# Altium project RPI_LP_Motor_Hat.PrjPcb
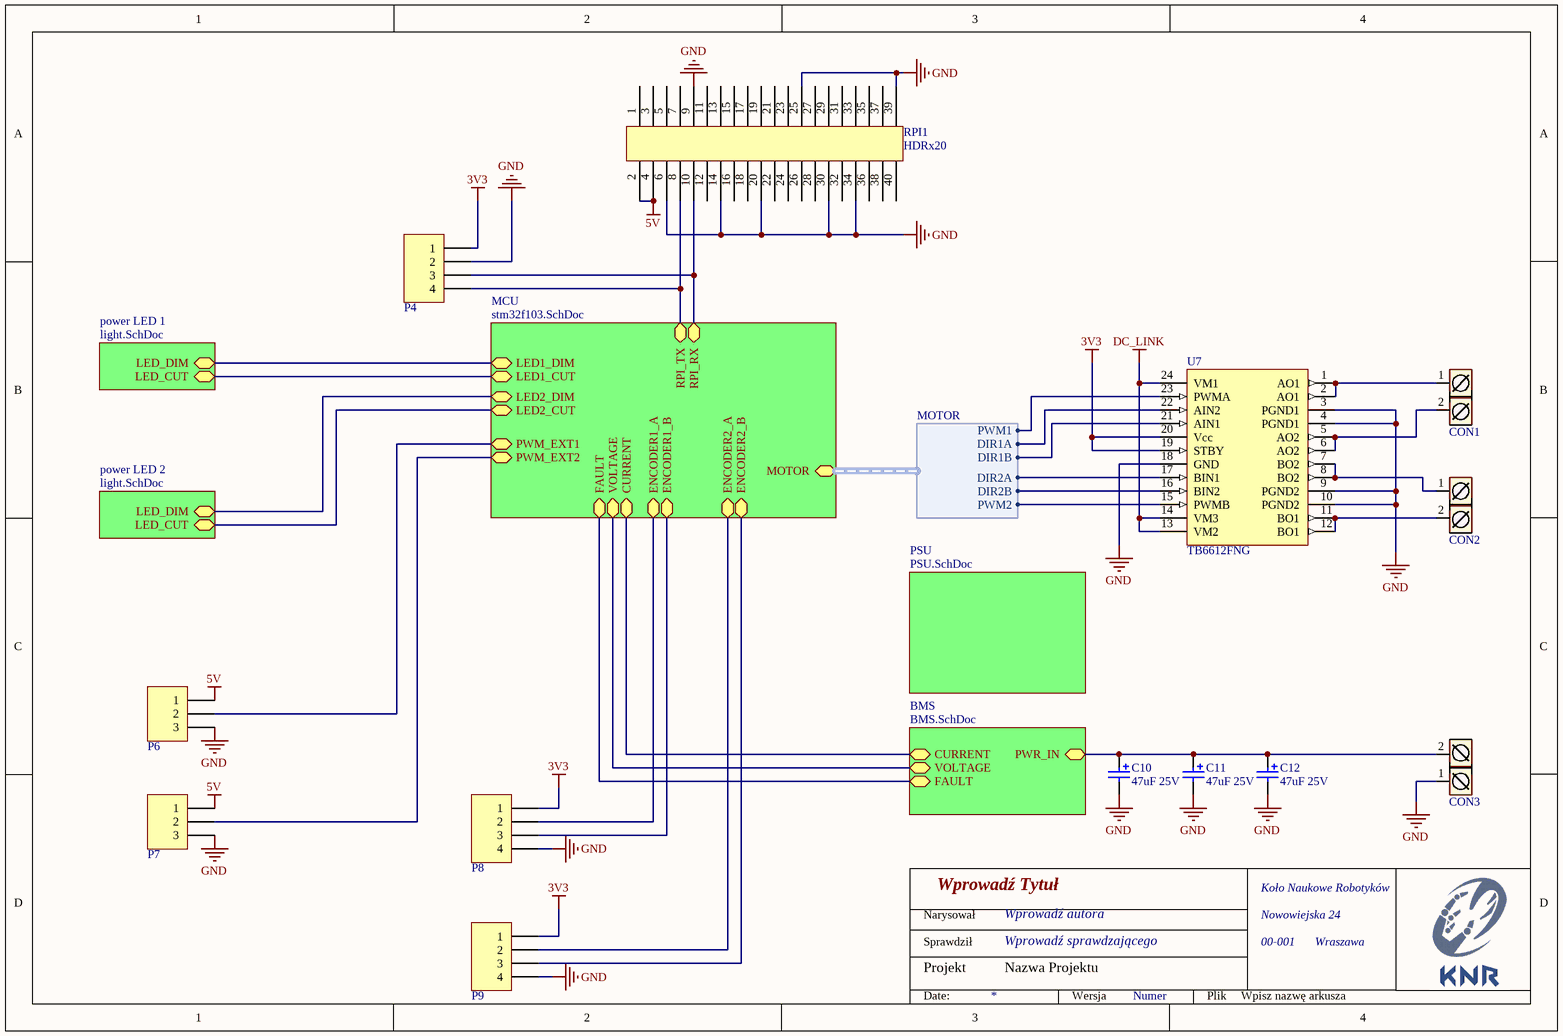
[diagram p0: motor hat.SchDoc]
5 sheets, 84 parts. Net scope: hierarchical (ports join the sheet entries above them; power ports are global).
Board file: RPI_LP_motor_hat.PcbDoc
Sheets:
  motor hat.SchDoc
    MCU = stm32f103.SchDoc
    PSU = PSU.SchDoc
    power LED 1 = light.SchDoc
    power LED 2 = light.SchDoc
    BMS = BMS.SchDoc

## Sheet motor hat.SchDoc: Wprowadź Tytuł
size A4; CheckedBy: Wprowadź sprawdzającego; DrawnBy: Wprowadź autora; Organization: Koło Naukowe Robotyków; Address1: Nowowiejska 24; Address2: 00-001; Address3: Wraszawa; Address4: Polska; Revision: Numer; Nazwa Arkusza: Wpisz nazwę arkusza; ProjectName: Nazwa Projektu

### Parts
C10  47uF 25V  [ELECTROLYTIC 5mm]
C11  47uF 25V  [ELECTROLYTIC 5mm]
C12  47uF 25V  [ELECTROLYTIC 5mm]
CON1  ARK2  [ARK2]  (value not drawn)
CON2  ARK2  [ARK2]  (value not drawn)
CON3  ARK2  [ARK2]  (value not drawn)
P4  HDR1X4  [HDR1X4]  (value not drawn)
P6  HDR1X3  [HDR1X3]  (value not drawn)
P7  HDR1X3  [HDR1X3]  (value not drawn)
P8  HDR1X4  [HDR1X4]  (value not drawn)
P9  HDR1X4  [HDR1X4]  (value not drawn)
RPI1  HDRx20  [HDR2x20]
U7  TB6612FNG  [SSOP24-P-300]

### Sub-sheets
BMS = BMS.SchDoc: PWR_IN, CURRENT, VOLTAGE, FAULT
MCU = stm32f103.SchDoc: LED1_DIM, LED2_DIM, LED2_CUT, LED1_CUT, PWM_EXT1, PWM_EXT2, CURRENT, VOLTAGE, FAULT, ENCODER1_A, ENCODER1_B, ENCODER2_A, ENCODER2_B, RPI_TX, RPI_RX, MOTOR (harness MOTOR)
power LED 1 = light.SchDoc: LED_CUT, LED_DIM
power LED 2 = light.SchDoc: LED_CUT, LED_DIM
PSU = PSU.SchDoc: no entries

### Harnesses
MOTOR: DIR2B, DIR2A, PWM2, PWM1, DIR1B, DIR1A

### Nets
3V3: P4.1 P8.1 P9.1 U7.19(STBY) U7.20(Vcc)
5V: P6.1 P7.1 RPI1.2 RPI1.4
DC_LINK: U7.13(VM2) U7.14(VM3) U7.24(VM1)
GND: C10.2 C11.2 C12.2 CON3.1 P4.2 P6.3 P7.3 P8.4 P9.4 RPI1.6 RPI1.9 RPI1.14 RPI1.20 RPI1.25 RPI1.30 RPI1.34 RPI1.39 U7.3(PGND1) U7.4(PGND1) U7.9(PGND2) U7.10(PGND2) U7.18(GND)
DIR1A: U7.22(AIN2) ; sheet MCU/MOTOR.DIR1A
DIR1B: U7.21(AIN1) ; sheet MCU/MOTOR.DIR1B
DIR2A: U7.17(BIN1) ; sheet MCU/MOTOR.DIR2A
DIR2B: U7.16(BIN2) ; sheet MCU/MOTOR.DIR2B
PWM1: U7.23(PWMA) ; sheet MCU/MOTOR.PWM1
PWM2: U7.15(PWMB) ; sheet MCU/MOTOR.PWM2
NetC2_2: sheet MCU/CURRENT, sheet BMS/CURRENT
NetC10_1: C10.1 C11.1 C12.1 CON3.2 ; sheet BMS/PWR_IN
NetCON1_1: CON1.1 U7.1(AO1) U7.2(AO1)
NetCON1_2: CON1.2 U7.5(AO2) U7.6(AO2)
NetCON2_1: CON2.1 U7.7(BO2) U7.8(BO2)
NetCON2_2: CON2.2 U7.11(BO1) U7.12(BO1)
NetP4_3: P4.3 RPI1.10 ; sheet MCU/RPI_RX
NetP4_4: P4.4 RPI1.8 ; sheet MCU/RPI_TX
NetP6_2: P6.2 ; sheet MCU/PWM_EXT1
NetP7_2: P7.2 ; sheet MCU/PWM_EXT2
NetP8_2: P8.2 ; sheet MCU/ENCODER1_A
NetP8_3: P8.3 ; sheet MCU/ENCODER1_B
NetP9_2: P9.2 ; sheet MCU/ENCODER2_A
NetP9_3: P9.3 ; sheet MCU/ENCODER2_B
NetR1_1: sheet MCU/FAULT, sheet BMS/FAULT
NetR2_1: sheet MCU/VOLTAGE, sheet BMS/VOLTAGE
NetR5_1_1: sheet MCU/LED1_CUT, sheet power LED 1/LED_CUT
NetR5_2_1: sheet MCU/LED2_CUT, sheet power LED 2/LED_CUT
NetU2_1_3: sheet MCU/LED1_DIM, sheet power LED 1/LED_DIM
NetU2_2_3: sheet MCU/LED2_DIM, sheet power LED 2/LED_DIM

Not connected (* = marked no-connect by the designer): RPI1 1 3 5 7 11 12 13 15 16 17 18 19 21 22 23 24 26 27 28 29 31 32 33 35 36 37 38 40

### Notes on the sheet
- Narysował
- Sprawdził
- Projekt
- Date:
- Wersja
- Plik

### Library data of the parts
C10-C12 = Electrolytic: Electrolytic capacitor; Value: 47uF 25V
CON1-CON3 = ARK2: Złącze śrubowe 2 piny
P4 P8 P9 = HDR1X4: Header, 4-Pin; LatestRevisionDate: 17-Jul-2002; LatestRevisionNote: Re-released for DXP Platform.; Publisher: Altium Limited
P6 P7 = HDR1X3: Header, 3-Pin; LatestRevisionDate: 17-Jul-2002; LatestRevisionNote: Re-released for DXP Platform.; Publisher: Altium Limited
U7 = TB6612FNG: Driver IC for Dual DC motor

## Sheet stm32f103.SchDoc: Wprowadź Tytuł
size A4; CheckedBy: Wprowadź sprawdzającego; DrawnBy: Wprowadź autora; Organization: Koło Naukowe Robotyków; Address1: Nowowiejska 24; Address2: 00-001; Address3: Wraszawa; Address4: Polska; Revision: Numer; Nazwa Arkusza: Wpisz nazwę arkusza; ProjectName: Nazwa Projektu
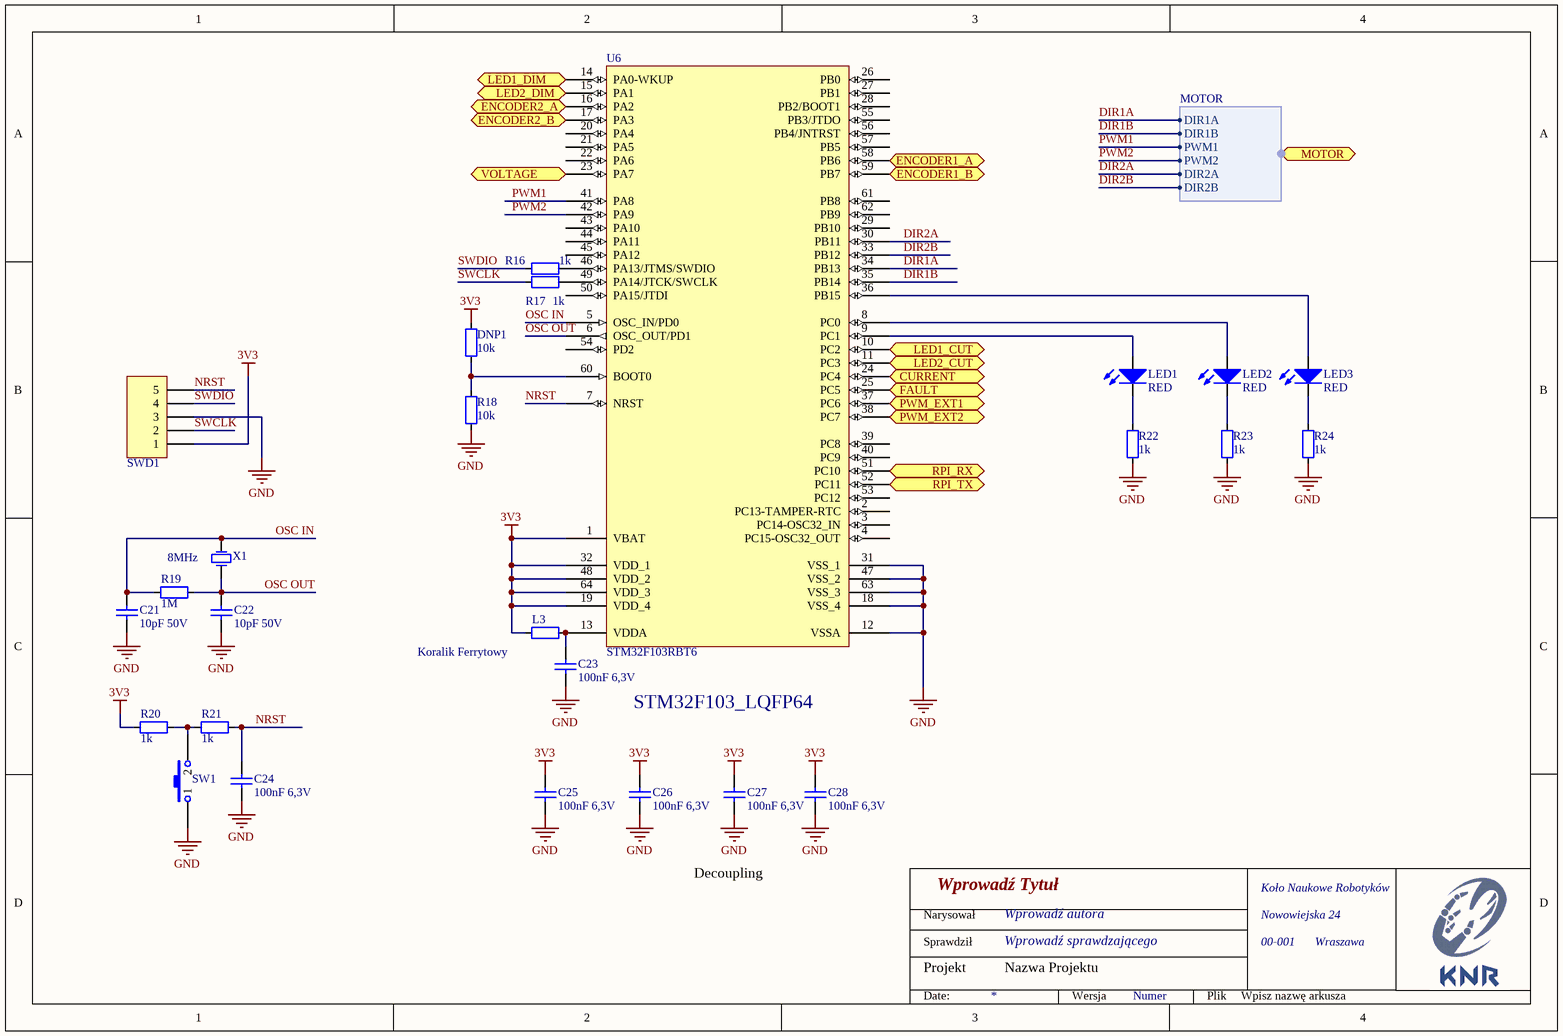
[diagram p1: stm32f103.SchDoc]

### Parts
C21  10pF 50V  [0603_CAP]
C22  10pF 50V  [0603_CAP]
C23  100nF 6,3V  [0603_CAP]
C24  100nF 6,3V  [0603_CAP]
C25  100nF 6,3V  [0603_CAP]
C26  100nF 6,3V  [0603_CAP]
C27  100nF 6,3V  [0603_CAP]
C28  100nF 6,3V  [0603_CAP]
DNP1  10k  [0603]
L3  Koralik Ferrytowy  [0603]
LED1  RED  [0603_led_green]
LED2  RED  [0603_led_red]
LED3  RED  [0603_led_blue]
R16  1k  [0603]
R17  1k  [0603]
R18  10k  [0603]
R19  1M  [0603]
R20  1k  [0603]
R21  1k  [0603]
R22  1k  [RES_0603]
R23  1k  [RES_0603]
R24  1k  [RES_0603]
SW1  Micro_Switch  [Tact 34N-F]  (value not drawn)
SWD1  HDR1X5  [Molex SPOX Horizontal 5 Circuits]  (value not drawn)
U6  STM32F103RBT6  [LQFP64_L]
X1  8MHz  [HC49-4H_THT]

### Ports
CURRENT, ENCODER1_A, ENCODER1_B, ENCODER2_A, ENCODER2_B, FAULT, LED1_CUT, LED1_DIM, LED2_CUT, LED2_DIM, MOTOR (harness MOTOR), PWM_EXT1, PWM_EXT2, RPI_RX, RPI_TX, VOLTAGE

### Harnesses
MOTOR: DIR2B, DIR2A, PWM2, PWM1, DIR1B, DIR1A

### Nets
3V3: C25.1 C26.1 C27.1 C28.1 DNP1.1 L3.1 R20.2 SWD1.1 U6.1(VBAT) U6.19(VDD_4) U6.32(VDD_1) U6.48(VDD_2) U6.64(VDD_3)
GND: C21.2 C22.2 C23.2 C24.2 C25.2 C26.2 C27.2 C28.2 R18.2 R22.1 R23.1 R24.1 SW1.1 SWD1.3 U6.12(VSSA) U6.18(VSS_4) U6.31(VSS_1) U6.47(VSS_2) U6.63(VSS_3)
DIR1A: U6.34(PB13) ; port MOTOR.DIR1A
DIR1B: U6.35(PB14) ; port MOTOR.DIR1B
DIR2A: U6.30(PB11) ; port MOTOR.DIR2A
DIR2B: U6.33(PB12) ; port MOTOR.DIR2B
NRST: C24.1 R21.1 SWD1.5 U6.7(NRST)
OSC IN: C21.1 R19.2 U6.5(OSC_IN/PD0) X1.1(OSC1)
OSC OUT: C22.1 R19.1 U6.6(OSC_OUT/PD1) X1.2(OSC2)
PWM1: U6.41(PA8) ; port MOTOR.PWM1
PWM2: U6.42(PA9) ; port MOTOR.PWM2
SWCLK: R17.1 SWD1.2
SWDIO: R16.1 SWD1.4
NetC2_2: U6.24(PC4) ; port CURRENT
NetC23_1: C23.1 L3.2 U6.13(VDDA)
NetDNP1_2: DNP1.2 R18.1 U6.60(BOOT0)
NetLED1_1: LED1.1(A) U6.9(PC1)
NetLED1_2: LED1.2(K) R22.2
NetLED2_1: LED2.1(A) U6.8(PC0)
NetLED2_2: LED2.2(K) R23.2
NetLED3_1: LED3.1(A) U6.36(PB15)
NetLED3_2: LED3.2(K) R24.2
NetP4_3: U6.51(PC10) ; port RPI_RX
NetP4_4: U6.52(PC11) ; port RPI_TX
NetP6_2: U6.37(PC6) ; port PWM_EXT1
NetP7_2: U6.38(PC7) ; port PWM_EXT2
NetP8_2: U6.58(PB6) ; port ENCODER1_A
NetP8_3: U6.59(PB7) ; port ENCODER1_B
NetP9_2: U6.16(PA2) ; port ENCODER2_A
NetP9_3: U6.17(PA3) ; port ENCODER2_B
NetR1_1: U6.25(PC5) ; port FAULT
NetR2_1: U6.23(PA7) ; port VOLTAGE
NetR5_1_1: U6.10(PC2) ; port LED1_CUT
NetR5_2_1: U6.11(PC3) ; port LED2_CUT
NetR16_2: R16.2 U6.46(PA13/JTMS/SWDIO)
NetR17_2: R17.2 U6.49(PA14/JTCK/SWCLK)
NetR20_1: R20.1 R21.2 SW1.2
NetU2_1_3: U6.14(PA0-WKUP) ; port LED1_DIM
NetU2_2_3: U6.15(PA1) ; port LED2_DIM

Not connected (* = marked no-connect by the designer): U6 2(PC13-TAMPER-RTC) 3(PC14-OSC32_IN) 4(PC15-OSC32_OUT) 20(PA4) 21(PA5) 22(PA6) 26(PB0) 27(PB1) 28(PB2/BOOT1) 29(PB10) 39(PC8) 40(PC9) 43(PA10) 44(PA11) 45(PA12) 50(PA15/JTDI) 53(PC12) 54(PD2) 55(PB3/JTDO) 56(PB4/JNTRST) 57(PB5) 61(PB8) 62(PB9)

### Notes on the sheet
- STM32F103_LQFP64
- Decoupling
- Narysował
- Sprawdził
- Projekt
- Date:
- Wersja
- Plik

### Library data of the parts
C21-C28 = Cap: Ceramic capacitor; Unit Price1: *; Unit Price2: *
  C21 C22: Value: 10pF 50V
  C23-C28: Value: 100nF 6,3V
DNP1 L3 R16-R21 = RES: Resistior
  DNP1 R18: Value: 10k
  L3: Value: Koralik Ferrytowy
  R16 R17 R20 R21: Value: 1k
  R19: Value: 1M
LED1-LED3 = LED: Light-emitting diode; COLOR: RED
R22-R24 = Resistor: Default resistor; Value: 1k
SW1 = Micro_Switch: Switch; Published: 24-Mar-1999; LatestRevisionDate: 17-Jul-2002; LatestRevisionNote: Re-released for DXP Platform.; PackageReference: SPST-2; Publisher: Altium Limited
SWD1 = HDR1X5: Header, 5-Pin; LatestRevisionDate: 17-Jul-2002; LatestRevisionNote: Re-released for DXP Platform.; Publisher: Altium Limited
U6 = STM32F103RBT6: STM32 ARM-based 32-bit; Published: 30-May-2008; DatasheetVersion: rev6, Mar-2008; PackageVersion: Mar-2008; PackageReference: LQFP64; Publisher: Altium Limited; PackageDescription: 64-Pin Low-Profile Quad Flat Pack, 10 x 10 mm Body, 0.5 mm Pitch (LQFP64); ComponentLink1Description: Manufacturer Link; ComponentLink1URL: www.st.com/stm32; ComponentLink2Description: Datasheet; ComponentLink2URL: http://www.st.com/stonline/products/literature/ds/13587.pdf
X1 = XTAL: Oscillator; Unit Price1: *; Unit Price2: *; Value: 8MHz

## Sheet PSU.SchDoc: Wprowadź Tytuł
size A4; CheckedBy: Wprowadź sprawdzającego; DrawnBy: Wprowadź autora; Organization: Koło Naukowe Robotyków; Address1: Nowowiejska 24; Address2: 00-001; Address3: Wraszawa; Address4: Polska; Revision: Numer; Nazwa Arkusza: Wpisz nazwę arkusza; ProjectName: Nazwa Projektu
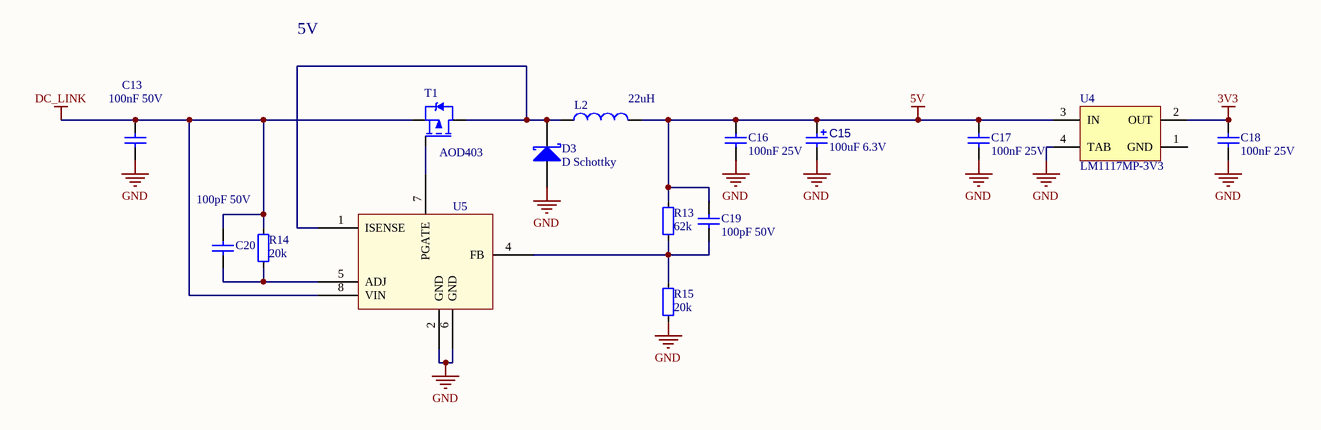
[diagram p2: PSU.SchDoc]

### Parts
C13  100nF 50V  [0603_CAP]
C15  100uF 6.3V  [Con_SMD_6.3x5.5]
C16  100nF 25V  [0603_CAP]
C17  100nF 25V  [0603_CAP]
C18  100nF 25V  [0603_CAP]
C19  100pF 50V  [0603_CAP]
C20  100pF 50V  [0603_CAP]
D3  D Schottky  [SMB]
L2  22uH  [PA4341.223ANLT]
R13  62k  [0603]
R14  20k  [0603]
R15  20k  [0603]
T1  AOD403  [DPAK TO-252]
U4  LM1117MP-3V3  [SOT223]
U5  LM3485  [VSSOP8]  (value not drawn)

### Nets
3V3: C18.2 U4.2(OUT)
5V: C15.1 C16.2 C17.2 C19.2 L2.2 R13.2 U4.3(IN)
DC_LINK: C13.2 C20.2 R14.2 T1.3(S) U5.8(VIN)
GND: C13.1 C15.2 C16.1 C17.1 C18.1 D3.1(A) R15.1 U4.4(TAB) U5.2(GND) U5.6(GND)
NetC19_1: C19.1 R13.1 R15.2 U5.4(FB)
NetC20_1: C20.1 R14.1 U5.5(ADJ)
NetD3_2: D3.2(K) L2.1 T1.2(D) U5.1(ISENSE)
NetT1_1: T1.1(G) U5.7(PGATE)

Not connected (* = marked no-connect by the designer): U4 1(GND)

### Notes on the sheet
- 5V
- Narysował
- Sprawdził
- Projekt
- Date:
- Wersja
- Plik

### Library data of the parts
C13 C16-C20 = Cap: Ceramic capacitor; Unit Price1: *; Unit Price2: *
  C13: Value: 100nF 50V
  C16-C18: Value: 100nF 25V
  C19 C20: Value: 100pF 50V
C15 = Cap_Pol: Polar capacitor; Value: 100uF 6.3V
D3 = D Schottky: Schottky Diode; Published: 8-Jun-2000; LatestRevisionDate: 17-Jul-2002; LatestRevisionNote: Re-released for DXP Platform.; PackageReference: SMB; Publisher: Altium Limited; PackageDescription: DO-214-AA/SMB; 2 C-Bend Leads; Body 5.3 x 3.6 mm, inc. leads (LxW); Code_JEDEC: DO-214-AA
L2 = Inductor
R13-R15 = RES: Resistior
  R13: Value: 62k
  R14 R15: Value: 20k
T1 = p-mosfet: AEC Generic p-mosfet; part_number: AOD403
U4 = LM1117MP-3V3: 800mA Low-Dropout Linear Regulator; PartNumber: LM1117MP-3.3; Manufacturer: National Semiconductor; CompType: LDO IC; PackageTopMarking: XYTT*N05A; PowerWise: N; Published: 4-Dec-2008; DatasheetVersion: Apr-2006; PackageVersion: revB, Apr-2003; PackageReference: MP04A; Publisher: Altium Limited; PackageDescription: Molded SOT-223, 6.50 x 3.56 x 1.6mm Body, 4 Lead, 2.3mm Pitch; RoHS: O; PinCount: 4; DigiKeyPartNumber: LM1117MP-3.3CT-ND; Code_JEDEC: TO-261-AA; Code_IPC: SOT223-4; ComponentLink1Description: LM1117 Datasheet; ComponentLink1URL: http://www.national.com/ds/LM/LM1117.pdf; ComponentLink2Description: LM1117 Web Page; ComponentLink2URL: http://www.national.com/pf/LM/LM1117.html; ComponentLink3Description: MP04A Package Page; ComponentLink3URL: http://www.national.com/packaging/folders/mp04a.html
U5 = LM3485: HelpURL: C:\Users\micha\Documents\Studia\Inżynierka\Elektronika\Datasheets\LM3485.pdf

## Sheet light.SchDoc: Wprowadź Tytuł
size A4; CheckedBy: Wprowadź sprawdzającego; DrawnBy: Wprowadź autora; Organization: Koło Naukowe Robotyków; Address1: Nowowiejska 24; Address2: 00-001; Address3: Wraszawa; Address4: Polska; Revision: Numer; Nazwa Arkusza: Wpisz nazwę arkusza; ProjectName: Nazwa Projektu
Used 2 times, as channels power LED 1, power LED 2. Parts and nets are listed once, with the designators drawn on the sheet.
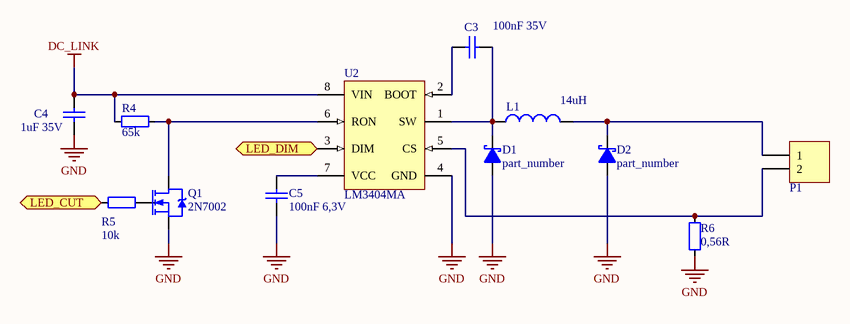
[diagram p3: light.SchDoc]

### Parts
C3  100nF 35V  [0603_CAP]
C4  1uF 35V  [0603_CAP]
C5  100nF 6,3V  [0603_CAP]
D1  part_number  [DO-219AB (SMF)]
D2  part_number  [DO-219AB (SMF)]
L1  14uH  [PA4341.223ANLT]
P1  HDR1X2  [HDR1X2]  (value not drawn)
Q1  2N7002  [Sot23]
R4  65k  [0603]
R5  10k  [0603]
R6  0,56R  [1206]
U2  LM3404MA  [M08A_N]

### Ports
LED_CUT, LED_DIM

### Nets
DC_LINK: C4.2 R4.1 U2.8(VIN)
GND: C4.1 C5.1 D1.1(A) D2.1(A) Q1.3(S) R6.1 U2.4(GND)
LED_CUT: R5.1 ; port LED_CUT
LED_DIM: U2.3(DIM) ; port LED_DIM
NetC3_1: C3.1 D1.2(K) L1.1 U2.1(SW)
NetC3_2: C3.2 U2.2(BOOT)
NetC5_2: C5.2 U2.7(VCC)
NetD2_2: D2.2(K) L1.2 P1.1
NetP1_2: P1.2 R6.2 U2.5(CS)
NetQ1_1: Q1.1(G) R5.2
NetQ1_2: Q1.2(D) R4.2 U2.6(RON)

### Channels
power LED 1: designators C3=C3_1 C4=C4_1 C5=C5_1 D1=D1_1 D2=D2_1 L1=L1_1 P1=PWR_LED1 Q1=Q1_1 R4=R4_1 R5=R5_1 R6=R6_1 U2=U2_1; ports LED_CUT=NetR5_1_1 LED_DIM=NetU2_1_3
power LED 2: designators C3=C3_2 C4=C4_2 C5=C5_2 D1=D1_2 D2=D2_2 L1=L1_2 P1=PWR_LED2 Q1=Q1_2 R4=R4_2 R5=R5_2 R6=R6_2 U2=U2_2; ports LED_CUT=NetR5_2_1 LED_DIM=NetU2_2_3

### Notes on the sheet
- Narysował
- Sprawdził
- Projekt
- Date:
- Wersja
- Plik

### Library data of the parts
C3-C5 = Cap: Ceramic capacitor; Unit Price1: *; Unit Price2: *
  C3: Value: 100nF 35V
  C4: Value: 1uF 35V
  C5: Value: 100nF 6,3V
D1 D2 = Schottky: part_number: part_number
L1 = Inductor
P1 = HDR1X2: Header, 2-Pin; LatestRevisionDate: 17-Jul-2002; LatestRevisionNote: Re-released for DXP Platform.; Publisher: Altium Limited
R4-R6 = RES: Resistior
  R4: Value: 65k
  R5: Value: 10k
  R6: Value: 0,56R
U2 = LM3404MA: 1.0A Constant Current Buck Regulator for High Power LED Drivers, 8-pin Narrow SOIC; Manufacturer: National Semiconductor; PackageTopMarking: NSZXTT*L3404*MA; PowerWise: Y; CompType: MiscPower; DatasheetVersion: Feb-2010; PackageVersion: revM, May-2009; PackageReference: M08A; PackageDescription: SOIC Narrow, 4.9 x 3.9 x 1.45mm, 8 Lead, 1.27mm Pitch; PartNumber: LM3404MA; RoHS: N; PinCount: 8; High-Reliability: Y; Code_JEDEC: MS-012-AA; Code_IPC: SOIC127P600-8; ComponentLink1Description: Manufacturer URL; ComponentLink1URL: http://www.national.com/; ComponentLink2Description: LM3404 Datasheet; ComponentLink2URL: http://www.national.com/ds/LM/LM3404.pdf; ComponentLink3Description: LM3404 Web Page; ComponentLink3URL: http://www.national.com/pf/LM/LM3404.html; ComponentLink4Description: M08A Package Page; ComponentLink4URL: http://www.national.com/packaging/folders/m08a.html; HelpURL: C:\Users\micha\Documents\Studia\Inżynierka\Elektronika\Datasheets\LM3404.pdf

## Sheet BMS.SchDoc: Wprowadź Tytuł
size A4; CheckedBy: Wprowadź sprawdzającego; DrawnBy: Wprowadź autora; Organization: Koło Naukowe Robotyków; Address1: Nowowiejska 24; Address2: 00-001; Address3: Wraszawa; Address4: Polska; Revision: Numer; Nazwa Arkusza: Wpisz nazwę arkusza; ProjectName: Nazwa Projektu
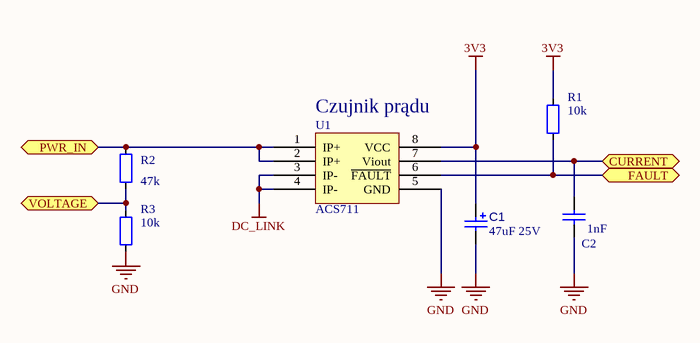
[diagram p4: BMS.SchDoc]

### Parts
C1  47uF 25V  [Con_SMD_5x5.5]
C2  1nF  [0603_CAP]
R1  10k  [0603]
R2  47k  [0603]
R3  10k  [0603]
U1  ACS711  [SO-8_N]

### Ports
CURRENT, FAULT, PWR_IN, VOLTAGE

### Nets
3V3: C1.1 R1.2 U1.8(VCC)
DC_LINK: U1.3(IP-) U1.4(IP-)
GND: C1.2 C2.1 R3.1 U1.5(GND)
NetC2_2: C2.2 U1.7(Viout) ; port CURRENT
NetC10_1: R2.2 U1.1(IP+) U1.2(IP+) ; port PWR_IN
NetR1_1: R1.1 U1.6(~{FAULT}) ; port FAULT
NetR2_1: R2.1 R3.2 ; port VOLTAGE

### Notes on the sheet
- (near U1) Czujnik prądu
- Narysował
- Sprawdził
- Projekt
- Date:
- Wersja
- Plik

### Library data of the parts
C1 = Cap_Pol: Polar capacitor; Value: 47uF 25V
C2 = Cap: Ceramic capacitor; Unit Price1: *; Unit Price2: *; Value: 1nF
R1-R3 = RES: Resistior
  R1 R3: Value: 10k
  R2: Value: 47k
U1 = ACS711: Current sensor. 12.5A or 25A at 3.3V; HelpURL: C:\Users\micha\Documents\Studia\Inżynierka\Elektronika\Datasheets\ACS711.pdf

## Nets that join several sheets
3V3: motor hat (5 pins), stm32f103 (13 pins), PSU (C18.2 U4.2), BMS (C1.1 R1.2 U1.8)
5V: motor hat (P6.1 P7.1 RPI1.2 RPI1.4), PSU (7 pins)
DC_LINK: motor hat (U7.13 U7.14 U7.24), PSU (5 pins), power LED 1 (C4_1.2 R4_1.1 U2_1.8), power LED 2 (C4_2.2 R4_2.1 U2_2.8), BMS (U1.3 U1.4)
GND: motor hat (22 pins), stm32f103 (19 pins), PSU (10 pins), power LED 1 (7 pins), power LED 2 (7 pins), BMS (C1.2 C2.1 R3.1 U1.5)
DIR1A: motor hat (U7.22), stm32f103 (U6.34)
DIR1B: motor hat (U7.21), stm32f103 (U6.35)
DIR2A: motor hat (U7.17), stm32f103 (U6.30)
DIR2B: motor hat (U7.16), stm32f103 (U6.33)
NetC2_2: stm32f103 (U6.24), BMS (C2.2 U1.7)
NetC10_1: motor hat (C10.1 C11.1 C12.1 CON3.2), BMS (R2.2 U1.1 U1.2)
NetP4_3: motor hat (P4.3 RPI1.10), stm32f103 (U6.51)
NetP4_4: motor hat (P4.4 RPI1.8), stm32f103 (U6.52)
NetP6_2: motor hat (P6.2), stm32f103 (U6.37)
NetP7_2: motor hat (P7.2), stm32f103 (U6.38)
NetP8_2: motor hat (P8.2), stm32f103 (U6.58)
NetP8_3: motor hat (P8.3), stm32f103 (U6.59)
NetP9_2: motor hat (P9.2), stm32f103 (U6.16)
NetP9_3: motor hat (P9.3), stm32f103 (U6.17)
NetR1_1: stm32f103 (U6.25), BMS (R1.1 U1.6)
NetR2_1: stm32f103 (U6.23), BMS (R2.1 R3.2)
NetR5_1_1: stm32f103 (U6.10), power LED 1 (R5_1.1)
NetR5_2_1: stm32f103 (U6.11), power LED 2 (R5_2.1)
NetU2_1_3: stm32f103 (U6.14), power LED 1 (U2_1.3)
NetU2_2_3: stm32f103 (U6.15), power LED 2 (U2_2.3)
PWM1: motor hat (U7.23), stm32f103 (U6.41)
PWM2: motor hat (U7.15), stm32f103 (U6.42)